# Altium schematic sheet 06_CAN&RS485.SchDoc
size A4; SheetNumber: 7; SheetTotal: 11
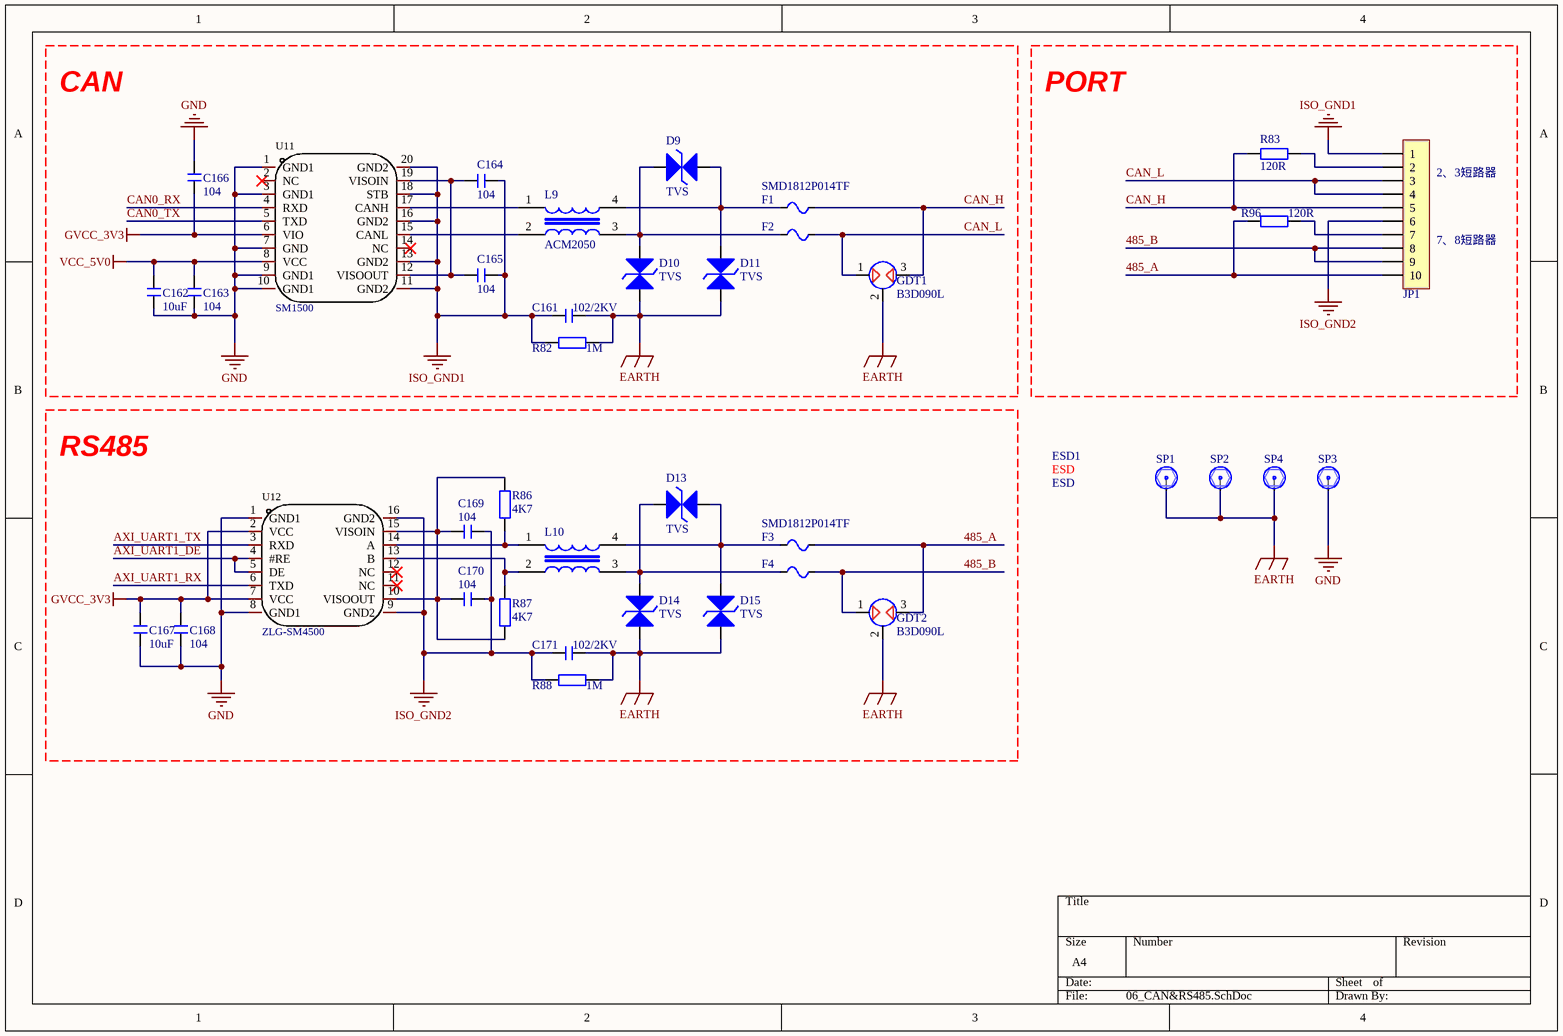
[diagram p0: 06_CAN&RS485.SchDoc]

## Parts
C161  102/2KV  [C 1206]
C162  10uF  [C 0805]
C163  104  [C 0603]
C164  104  [C 0603]
C165  104  [C 0603]
C166  104  [C 0603]
C167  10uF  [C 0805]
C168  104  [C 0603]
C169  104  [C 0603]
C170  104  [C 0603]
C171  102/2KV  [C 1206]
D9  TVS  [SMA]
D10  TVS  [SMA]
D11  TVS  [SMA]
D13  TVS  [SMA]
D14  TVS  [SMA]
D15  TVS  [SMA]
ESD1  ESD  [ESD]
F1  SMD1812P014TF  [PLCC-1812]
F2  SMD1812P014TF  [PLCC-1812]  (value not drawn)
F3  SMD1812P014TF  [PLCC-1812]
F4  SMD1812P014TF  [PLCC-1812]  (value not drawn)
GDT1  B3D090L  [B3D090L]
GDT2  B3D090L  [B3D090L]
JP1  HDR-1X10  [KF2EDGE_3.81_10P]  (value not drawn)
L9  ACM2050  [ACM2520]
L10  共模电感  [ACM2520]  (value not drawn)
R82  1M  [R 1206]
R83  120R  [R 1206]
R86  4K7  [R 0603]
R87  4K7  [R 0603]
R88  1M  [R 1206]
R96  120R  [R 1206]
SP1  M3铜柱  [M3-HOLE]  (value not drawn)
SP2  M3铜柱  [M3-HOLE]  (value not drawn)
SP3  M3铜柱  [M3-HOLE]  (value not drawn)
SP4  M3铜柱  [M3-HOLE]  (value not drawn)
U11  SM1500  [DFN-20_12,5x9.9]
U12  ZLG-SM4500  [DFN-16]

## Nets
EARTH: C161.2 C171.2 D10.1(A) D11.2(K) D14.1(A) D15.2(K) GDT1.2 GDT2.2 R82.2 R88.2 SP1.1 SP2.1 SP4.1
GND: C162.1 C163.1 C166.2 C167.1 C168.1 SP3.1 U11.1(GND1) U11.3(GND1) U11.7(GND) U11.9(GND1) U11.10(GND1) U12.1(GND1) U12.8(GND1)
GVCC_3V3: C166.1 C167.2 C168.2 U11.6(VIO) U12.2(VCC) U12.7(VCC)
ISO_GND1: C161.1 C164.1 C165.2 JP1.1 R82.1 U11.11(GND2) U11.13(GND2) U11.16(GND2) U11.18(STB) U11.20(GND2)
ISO_GND2: C169.2 C170.2 C171.1 JP1.6 R88.1 U12.9(GND2) U12.16(GND2)
VCC_5V0: C162.2 C163.2 U11.8(VCC)
485_A: F3.2 GDT2.3 JP1.10 R96.2
485_B: F4.2 GDT2.1 JP1.8 JP1.9
AXI_UART1_DE: U12.4(#RE) U12.5(DE)
AXI_UART1_RX: U12.6(TXD)
AXI_UART1_TX: U12.3(RXD)
CAN0_RX: U11.4(RXD)
CAN0_TX: U11.5(TXD)
CAN_H: F1.2 GDT1.3 JP1.5 R83.2
CAN_L: F2.2 GDT1.1 JP1.3 JP1.4
NetC164_2: C164.2 C165.1 U11.12(VISOOUT) U11.19(VISOIN)
NetC169_1: C169.1 C170.1 R86.2 R87.1 U12.10(VISOOUT) U12.15(VISOIN)
NetD9_1: D9.1(A) D11.1(A) F1.1 L9.4
NetD9_2: D9.2(K) D10.2(K) F2.1 L9.3
NetD13_1: D13.1(A) D15.1(A) F3.1 L10.4
NetD13_2: D13.2(K) D14.2(K) F4.1 L10.3
NetJP1_2: JP1.2 R83.1
NetJP1_7: JP1.7 R96.1
NetL9_1: L9.1 U11.17(CANH)
NetL9_2: L9.2 U11.15(CANL)
NetL10_1: L10.1 R86.1 U12.14(A)
NetL10_2: L10.2 R87.2 U12.13(B)

Not connected (* = marked no-connect by the designer): U11 2(NC)* 14(NC)*; U12 11(NC)* 12(NC)*

## Notes on the sheet
- CAN
- PORT
- (near JP1) 2、3短路器
- (near JP1) 7、8短路器
- RS485

## Library data of the parts
C161-C171 = C: 无极性贴片电容; 版权归属: 源创客; BOM名称: 无极性贴片电容; 学习资源: www.ooocke.com
ESD1 = ESD: 防静电; BOM名称: 散热片; 版权归属: 源创客; 学习资源: www.ooocke.com
F1-F4 = FU: 贴片保险丝; 版权归属: 源创客; BOM名称: 贴片保险丝; 学习资源: www.ooocke.com
JP1 = Header 10: 10P接插件; 版权归属: 源创客; BOM名称: 10P接插件; 学习资源: www.ooocke.com
L9 = 共模电感
R82 R83 R86-R88 R96 = R: 贴片电阻; 版权归属: 源创客; BOM名称: 贴片电阻; 学习资源: www.ooocke.com
SP1-SP4 = 铜柱大焊盘: 铜柱; 版权归属: 源创客; BOM名称: 铜柱; 学习资源: www.ooocke.com
U11 = SM1500: Manufacturer: ZLG(致远电子); Add into BOM: yes; Name: SM1500; Symbol: SM1500; Device: SM1500; LCSC Part Name: SM1500; Supplier Part: C2879955; Manufacturer Part: SM1500; Supplier Footprint: DFN-20; JLCPCB Part Class: Extended Part; Datasheet: https://atta.szlcsc.com/upload/public/pdf/source/20210825/C2879955_A99A3E3BA6E3BB620860F39BC584C05F.pdf; Supplier: LCSC; Convert to PCB: yes
U12 = ZLG-SM4500: Manufacturer: MORNSUN(金升阳); Name: TD541S485H; Add into BOM: yes; Types: 收发器; Data Rate: 1Mbps; Node Number: 256; Supply Voltage: 5.5V；3.3V; ESD Protect: ±15kV; Whether the isolation: 是; Symbol: TD541S485H; Device: TD541S485H; LCSC Part Name: 3.3V或5.5V供电 1Mbps 带静电保护收发器 MSL=3，上机前请烘烤; Supplier Part: C707458; Manufacturer Part: TD541S485H; Supplier Footprint: DFN-16(10x13); JLCPCB Part Class: Extended Part; Datasheet: https://atta.szlcsc.com/upload/public/pdf/source/20200720/C707457_1DF1C6EE65ECD3D3F30F36237E18355C.pdf; Supplier: LCSC; Convert to PCB: yes; Driver/receiver: -; Operating Temperature: -40℃~+105℃